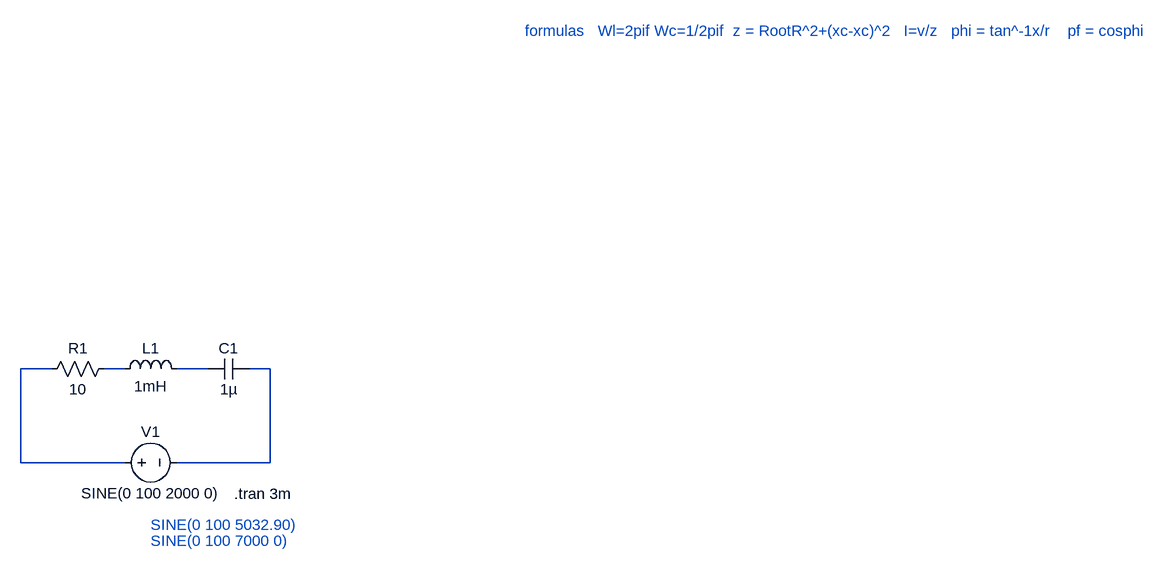
[diagram p0: schematic RLC.asc]
RLC.asc, the LTspice schematic file:
Version 4
SHEET 1 1868 680
WIRE 32 96 -16 96
WIRE 144 96 112 96
WIRE 272 96 224 96
WIRE 368 96 336 96
WIRE -16 240 -16 96
WIRE 144 240 -16 240
WIRE 368 240 368 96
WIRE 368 240 224 240
SYMBOL res 128 80 R90
WINDOW 0 0 56 VBottom 2
WINDOW 3 32 56 VTop 2
SYMATTR InstName R1
SYMATTR Value 10
SYMBOL ind 128 112 R270
WINDOW 0 32 56 VTop 2
WINDOW 3 5 56 VBottom 2
SYMATTR InstName L1
SYMATTR Value 1mH
SYMBOL cap 336 80 R90
WINDOW 0 0 32 VBottom 2
WINDOW 3 32 32 VTop 2
SYMATTR InstName C1
SYMATTR Value 1µ
SYMBOL voltage 128 240 R270
WINDOW 0 32 56 VTop 2
WINDOW 3 -32 56 VBottom 2
WINDOW 123 0 0 Left 0
WINDOW 39 0 0 Left 0
SYMATTR InstName V1
SYMATTR Value SINE(0 100 2000 0)
TEXT 184 336 Left 2 ;SINE(0 100 5032.90)
TEXT 184 360 Left 2 ;SINE(0 100 7000 0)
TEXT 312 288 Left 2 !.tran 3m
TEXT 760 -424 Left 2 ;formulas   Wl=2pif Wc=1/2pif  z = RootR^2+(xc-xc)^2   I=v/z   phi = tan^-1x/r    pf = cosphi

The netlist it stands for:
* RLC.asc
R1 N002 N001 10
L1 N002 N003 1mH
C1 N004 N003 1µ
V1 N001 N004 SINE(0 100 2000 0)
* SINE(0 100 5032.90)
* SINE(0 100 7000 0)
.tran 3m
* formulas   Wl=2pif Wc=1/2pif  z = RootR^2+(xc-xc)^2   I=v/z   phi = tan^-1x/r    pf = cosphi
.backanno
.end